# Altium schematic sheet main.SchDoc
size A3
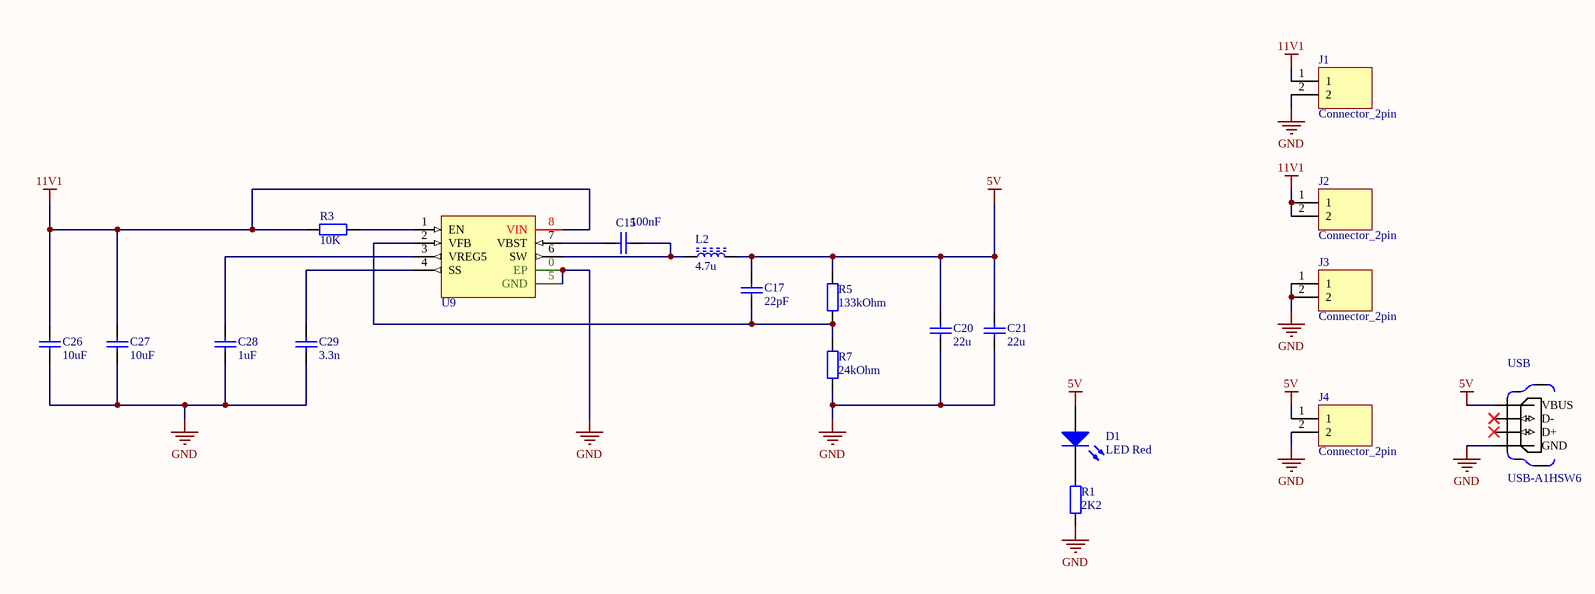
[diagram p0: main.SchDoc]

## Parts
C15  100nF  [FP_0805_CAP_085]
C17  22pF  [FP_0805_CAP_085]
C20  Capacitance: 22u  [1210]  (hidden comment: CL32A226KOJNNNE)
C21  Capacitance: 22u  [1210]  (hidden comment: CL32A226KOJNNNE)
C26  Capacitance: 10uF  [1210]  (hidden comment: 885012209005)
C27  Capacitance: 10uF  [1210]  (hidden comment: 885012209005)
C28  Capacitance: 1uF  [0805]  (hidden comment: VJ0805Y105KXQTW1BC)
C29  Capacitance: 3.3n  [0805]  (hidden comment: CC0805JRNP08BN332)
D1  LED Red  [FP_0805_LED_RED]
J1  Connector_2pin  [PT_2-5]
J2  Connector_2pin  [PT_2-5]
J3  Connector_2pin  [PT_2-5]
J4  Connector_2pin  [PT_2-5]
L2  Inductance: 4.7u  [TDK_IND_6045]  (hidden comment: VLS6045EX-4R7M)
R1  2K2  [FP_0805_RES]
R3  10K  [FP_0805_RES]
R5  Resistance: 133kOhm  [0805-W]  (hidden comment: CR0805-FX-1333ELF)
R7  Resistance: 24kOhm  [0805-W]  (hidden comment: CR0805-FX-2402ELF)
U9  TPS54227DDAR  [8-Pin HSOP with ThermalPad]  (value not drawn)
USB  USB-A1HSW6  [*OST_USB-A1HSW6]

## Nets
5V: C17.2 C20.2 C21.2 D1.1(A) J4.1 L2.2 R5.2 USB.1(VBUS)
11V1: C26.2 C27.2 J1.1 J2.1 J2.2 R3.1 U9.8(VIN)
GND: C20.1 C21.1 C26.1 C27.1 C28.1 C29.1 J1.2 J3.1 J3.2 J4.2 R1.1 R7.1 U9.0(EP) U9.5(GND) USB.4(GND)
NetC15_1: C15.1 U9.7(VBST)
NetC15_2: C15.2 L2.1 U9.6(SW)
NetC17_1: C17.1 R5.1 R7.2 U9.2(VFB)
NetC28_2: C28.2 U9.3(VREG5)
NetC29_2: C29.2 U9.4(SS)
NetD1_2: D1.2(K) R1.2
NetR3_2: R3.2 U9.1(EN)

Not connected (* = marked no-connect by the designer): USB 2(D-)* 3(D+)*

## Library data of the parts
C15 = CAP 100nF: Capacitor; Tolerance: +80%/-20%; Voltage: 25V; Reference: 1759167; Name: SMD Multilayer Ceramic Capacitor, 0805; Supplier: Farnell; Value: 100nF
C17 = CAP 22pF: Capacitor; Tolerance: 5%; Voltage: 50V; Reference: 1759195; Name: SMD Multilayer Ceramic Capacitor, 0805; Supplier: Farnell; Value: 22pF
C20 C21 = CL32A226KOJNNNE: 22uF 1210 10% 16V X5R CL32A226KOJNNNE (SAM) [ 82-08-05 ]
C26 C27 = 885012209005: SMD Multilayer Ceramic Capacitor, 1210 [3225 Metric], 10 µF, 10 V, ± 10%, X7R, WCAP-CSGP Series
C28 = VJ0805Y105KXQTW1BC: SMD Multilayer Ceramic Capacitor, 0805 [2012 Metric], 1 µF, 10 V, ± 10%, X7R, VJ Series
C29 = CC0805JRNP08BN332: 3.3nF 0805 5% 25V NP0 CC0805JRNP08BN332 (YAG) [ 82-04-69 ]
D1 = LED Red: Red LED; pin to pad: 1>A 2>K; U_fw: 1.85V; I_max: 20mA; Reference: 1581239; Name: MULTICOMP  MCL-S270SRC  LED, Red, SMD, 1.25mm x 1.4mm, 20 mA, 1.85 V, 643 nm; Wavelength: 643nm; Supplier: Farnell
L2 = VLS6045EX-4R7M: Power Inductor (SMD), 4.7 µH, 4.2 A, Wirewound, 5.8 A, VLS-EX Series, 6mm x 6mm x 4.5mm
R1 = RES 2K2: Resistor; Tolerance: 1%; Power: 125mW; Name: VISHAY  CRCW08052K20FKEA  SMD Chip Resistor, Thick Film, 2.2 kohm, 150 V, 0805 [2012 Metric], 125 mW, ± 1%, CRCW Series; Reference: 1469887; Supplier: Farnell; Value: 2K2
R3 = RES 10K: Resistor; Tolerance: 5%; Power: 125mW; Name: YAGEO (PHYCOMP)  RC0805JR-0710KL  SMD Chip Resistor, Thick Film, 10 kohm; Reference: 9234136; Supplier: Farnell; Value: 10K
R5 = CR0805-FX-1333ELF: SMD Chip Resistor, 133kOhm, 0805
R7 = CR0805-FX-2402ELF: SMD Chip Resistor, 24kOhm, 0805
U9 = TPS54227DDAR: DC-DC Switching (Step Down) Regulator, Adjustable, 700 kHz, 4.5-18Vin, up to 7V/2Aout, SO PowerPAD-8
USB = USB-A1HSW6: USB - A Receptacle Connector 4 Position Through Hole, Right Angle; MF: On Shore; MP: USB-A1HSW6; Package: None; SnapEDA_Link: https://www.snapeda.com/parts/USB-A1HSW6/On%20Shore%20Technology%20Inc./view-part/13110/?ref=snap; Availability: Unavailable; Price: None; Value: *